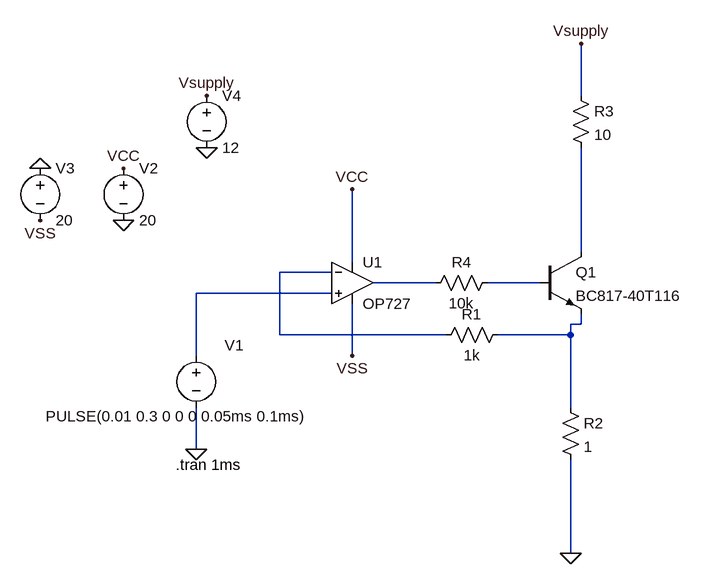
[diagram p0: schematic 6432106821-PB4.asc]
6432106821-PB4.asc, the LTspice schematic file:
Version 4
SHEET 1 880 680
WIRE 400 -160 400 -240
WIRE 400 80 400 -80
WIRE 48 96 48 -16
WIRE 16 112 -64 112
WIRE 176 128 80 128
WIRE 336 128 256 128
WIRE 16 144 -192 144
WIRE 400 192 400 176
WIRE 400 192 384 192
WIRE -64 208 -64 112
WIRE 192 208 -64 208
WIRE 384 208 384 192
WIRE 384 208 272 208
WIRE -192 240 -192 144
WIRE 48 240 48 160
WIRE 384 320 384 208
WIRE -192 384 -192 320
WIRE 384 544 384 400
FLAG -192 384 0
FLAG 48 -16 VCC
FLAG -304 -48 VCC
FLAG -304 32 0
FLAG 48 240 VSS
FLAG -432 -48 0
FLAG -432 32 VSS
FLAG -176 -160 Vsupply
FLAG -176 -80 0
FLAG 400 -240 Vsupply
FLAG 384 544 0
SYMBOL voltage -192 224 R0
WINDOW 123 0 0 Left 0
WINDOW 39 0 0 Left 0
WINDOW 0 44 0 Left 2
WINDOW 3 -232 109 Left 2
SYMATTR InstName V1
SYMATTR Value PULSE(0.01 0.3 0 0 0 0.05ms 0.1ms)
SYMBOL voltage -304 -64 R0
WINDOW 123 0 0 Left 0
WINDOW 39 0 0 Left 0
SYMATTR InstName V2
SYMATTR Value 20
SYMBOL Opamps\\OP727 48 64 R0
SYMATTR InstName U1
SYMBOL voltage -432 -64 R0
WINDOW 123 0 0 Left 0
WINDOW 39 0 0 Left 0
SYMATTR InstName V3
SYMATTR Value 20
SYMBOL res 288 192 R90
WINDOW 0 0 56 VBottom 2
WINDOW 3 32 56 VTop 2
SYMATTR InstName R1
SYMATTR Value 1k
SYMBOL res 368 304 R0
SYMATTR InstName R2
SYMATTR Value 1
SYMBOL res 384 -176 R0
SYMATTR InstName R3
SYMATTR Value 10
SYMBOL res 272 112 R90
WINDOW 0 0 56 VBottom 2
WINDOW 3 32 56 VTop 2
SYMATTR InstName R4
SYMATTR Value 10k
SYMBOL voltage -176 -176 R0
WINDOW 123 0 0 Left 0
WINDOW 39 0 0 Left 0
SYMATTR InstName V4
SYMATTR Value 12
SYMBOL npn 336 80 R0
SYMATTR InstName Q1
SYMATTR Value BC817-40T116
TEXT -224 408 Left 2 !.tran 1ms

The netlist it stands for:
* 6432106821-PB4.asc
V1 N005 0 PULSE(0.01 0.3 0 0 0 0.05ms 0.1ms)
V2 VCC 0 20
XU1 N005 N002 VCC VSS N003 OP727  ; pins In+ In- V+ V- OUT
V3 0 VSS 20
R1 N006 N002 1k
R2 N006 0 1
R3 Vsupply N001 10
R4 N004 N003 10k
V4 Vsupply 0 12
Q1 N001 N004 N006 0 BC817-40T116
.model NPN NPN
.model PNP PNP
.lib standard.bjt
.tran 1ms
.backanno
.end